# Altium schematic sheet 1.5V.SchDoc
size A4; SheetNumber: 5; SheetTotal: 8
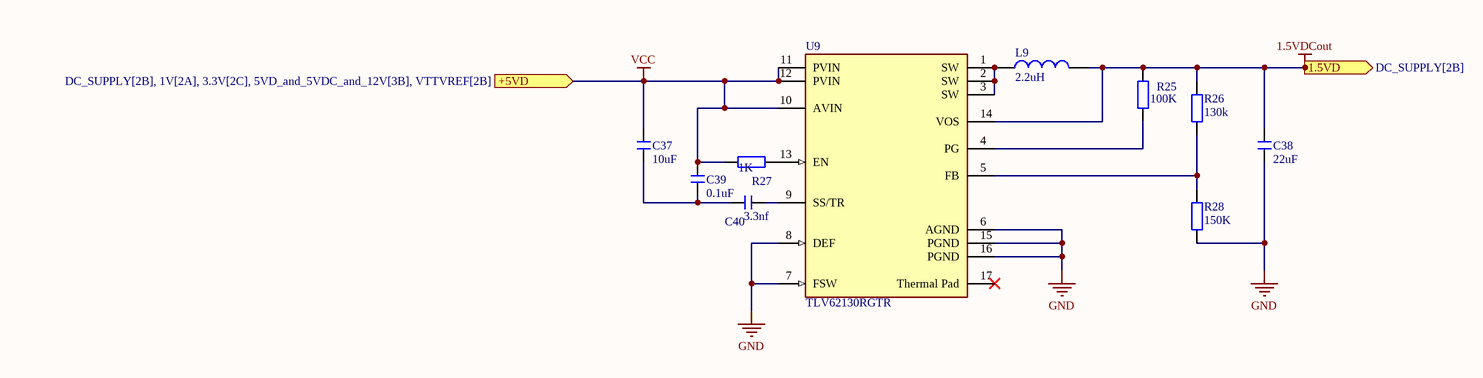
[diagram p0: 1.5V.SchDoc]

## Parts
C37  10uF  [C 0805_L]
C38  22uF  [C 0805_L]
C39  0.1uF  [C 0805_L]
C40  3.3nf  [C 0805_L]
L9  2.2uH  [L 0805]
R25  100K  [R 0805_L]
R26  130k  [R 0805_L]
R27  1K  [R 0805_L]
R28  150K  [R 0805_L]
U9  TLV62130RGTR  [FP-RGT0016C-IPC_A]

## Ports
1.5VD (out, see DC_SUPPLY[2B]), +5VD (in, see DC_SUPPLY[2B], 1V[2A], 3.3V[2C], 5VD_and_5VDC_and_12V[3B], VTTVREF[2B])

## Nets
1.5VDCout: C38.2 L9.2 R25.2 R26.2 U9.14(VOS) ; port 1.5VD
GND: C38.1 R28.1 U9.6(AGND) U9.7(FSW) U9.8(DEF) U9.15(PGND) U9.16(PGND)
VCC: C37.2 C39.2 R27.1 U9.10(AVIN) U9.11(PVIN) U9.12(PVIN) ; port +5VD
NetC37_1: C37.1 C39.1 C40.1
NetC40_2: C40.2 U9.9(SS/TR)
NetL9_1: L9.1 U9.1(SW) U9.2(SW) U9.3(SW)
NetR25_1: R25.1 U9.4(PG)
NetR26_1: R26.1 R28.2 U9.5(FB)
NetR27_2: R27.2 U9.13(EN)

Not connected (* = marked no-connect by the designer): U9 17(Thermal_Pad)*

## Library data of the parts
C37 = C: 贴片电容 10 µF, 25 V, Ceramic, 1210 Standard; BOM名称: 无极性贴片电容; 淘宝ID: 封装库来自淘宝 ID：黄晶宝石; 联系售后，技术支持: https://shop463601444.taobao.com; 唯一出售店铺网址: https://shop463601444.taobao.com
C38 = C: 贴片电容 22 µF, 6.3 V, Ceramic, 0805 Standard; BOM名称: 无极性贴片电容; 淘宝ID: 封装库来自淘宝 ID：黄晶宝石; 联系售后，技术支持: https://shop463601444.taobao.com; 唯一出售店铺网址: https://shop463601444.taobao.com
C39 = C: 贴片电容 0.1 µF, 25V, Ceramic, 0603; BOM名称: 无极性贴片电容; 淘宝ID: 封装库来自淘宝 ID：黄晶宝石; 联系售后，技术支持: https://shop463601444.taobao.com; 唯一出售店铺网址: https://shop463601444.taobao.com
C40 = C: 贴片电容 3300 pF, 25 V, Ceramic, 0603; BOM名称: 无极性贴片电容; 淘宝ID: 封装库来自淘宝 ID：黄晶宝石; 联系售后，技术支持: https://shop463601444.taobao.com; 唯一出售店铺网址: https://shop463601444.taobao.com
L9 = L: 小功率贴片电感 2.2 µH, 0.165 × 0.165 in XFL4020-222MEB, Coilcraft; 淘宝ID: 封装库来自淘宝 ID：黄晶宝石; 封装库来自淘宝卖家 ID：黄晶宝石: 其他店铺购入均为盗版，不享受售后技术支持服务，请立即申请退款; BOM名称: 小功率贴片电感; 联系售后: https://shop463601444.taobao.com
R25 = R: 贴片电阻 100 kΩ, Chip, 0603, 1/16W, 1%; 版权归属: 来自淘宝 ID：黄晶宝石; 封装库来自淘宝卖家 ID：黄晶宝石: 其他店铺购入均为盗版，不享受售后技术支持服务，请立即申请退款; BOM名称: 贴片电阻; 联系售后: https://shop463601444.taobao.com
R26 R28 = R: 贴片电阻; 版权归属: 来自淘宝 ID：黄晶宝石; 封装库来自淘宝卖家 ID：黄晶宝石: 其他店铺购入均为盗版，不享受售后技术支持服务，请立即申请退款; BOM名称: 贴片电阻; 联系售后: https://shop463601444.taobao.com
R27 = R: 贴片电阻R1 IMPORTANT, TO PREVENT HV DAMAGE; BOM名称: 贴片电阻; 版权归属: 来自淘宝 ID：黄晶宝石; 封装库来自淘宝卖家 ID：黄晶宝石: 其他店铺购入均为盗版，不享受售后技术支持服务，请立即申请退款; 联系售后: https://shop463601444.taobao.com
U9 = CMP-04918-000039-1: IC REG BUCK ADJUSTABLE 3A 16QFN; Manufacturer: Texas Instruments; Min Supply Voltage: 3V; Max Junction Temp: +125°C; Output Type: AdjustableProgrammable; Number Of Outputs: 1; Nominal Supply Current: 19uA; Standoff Height: 0mm; Max Supply Voltage: 17V; Switching Frequency: 1.25/2.5MHz; Max Duty Cycle: 100%; Output Voltage: 0.9-5.5V; ComponentLink2Description: Datasheet; Category: IC; Manufacturer Part Number: TLV62130RGTR; Mouser Description: Switching Voltage Regulators 4-17V 3A Step-Down Converter; Output Current: 3A; Ambient Temperature Range Low: -40°C; Package: RGT0016C; Lead Free: Yes; Temperature Range Low: -40°C; Digikey Description: IC REG BUCK ADJUSTABLE 3A 16QFN; Height: 1mm; Device Class L3: Voltage Regulators - Switching; Device Class L1: Integrated Circuits (ICs); Switching Topology: Buck; Ambient Temperature Range High: +85°C; RoHS: TRUE; Ipc Land Pattern Name: QFN50P300X300X100-16; Temperature: -40°C to +85°C; Octopart: https://octopart.com/tlv62130rgtr-texas+instruments-21766117; Device Class L2: Power Management ICs; Temperature Range High: +85°C; Automotive: No; ComponentLink2URL: http://www.ti.com/lit/ds/symlink/tlv62130.pdf